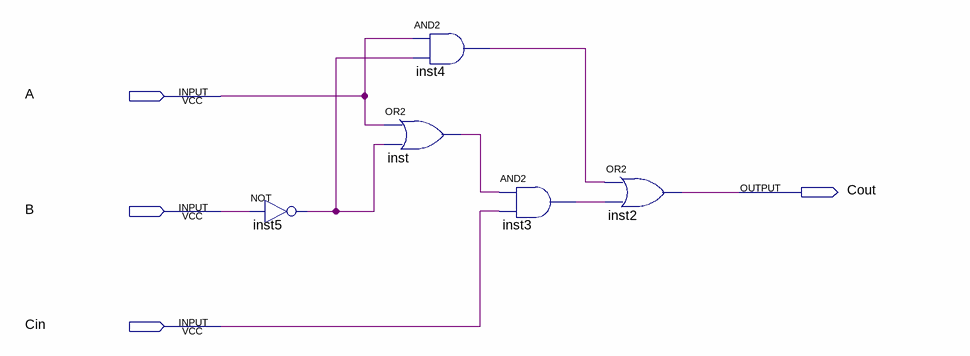
[diagram p0: schematic sheet]
// Quartus schematic MAIOR1-DIAGRAMA.bdf as structural Verilog: 5 symbols, 4 pins
module \MAIOR1-DIAGRAMA  (
  input  A,
  input  B,
  input  Cin,
  output Cout
);

  wire inst3_out, inst4_out, inst5_out, inst_out;

  not inst5 (inst5_out, B);
  and inst4 (inst4_out, A, inst5_out);
  or inst (inst_out, A, inst5_out);
  and inst3 (inst3_out, inst_out, Cin);
  or inst2 (Cout, inst4_out, inst3_out);
endmodule
